# Altium project AQM with ESP32-C3.PrjPcb
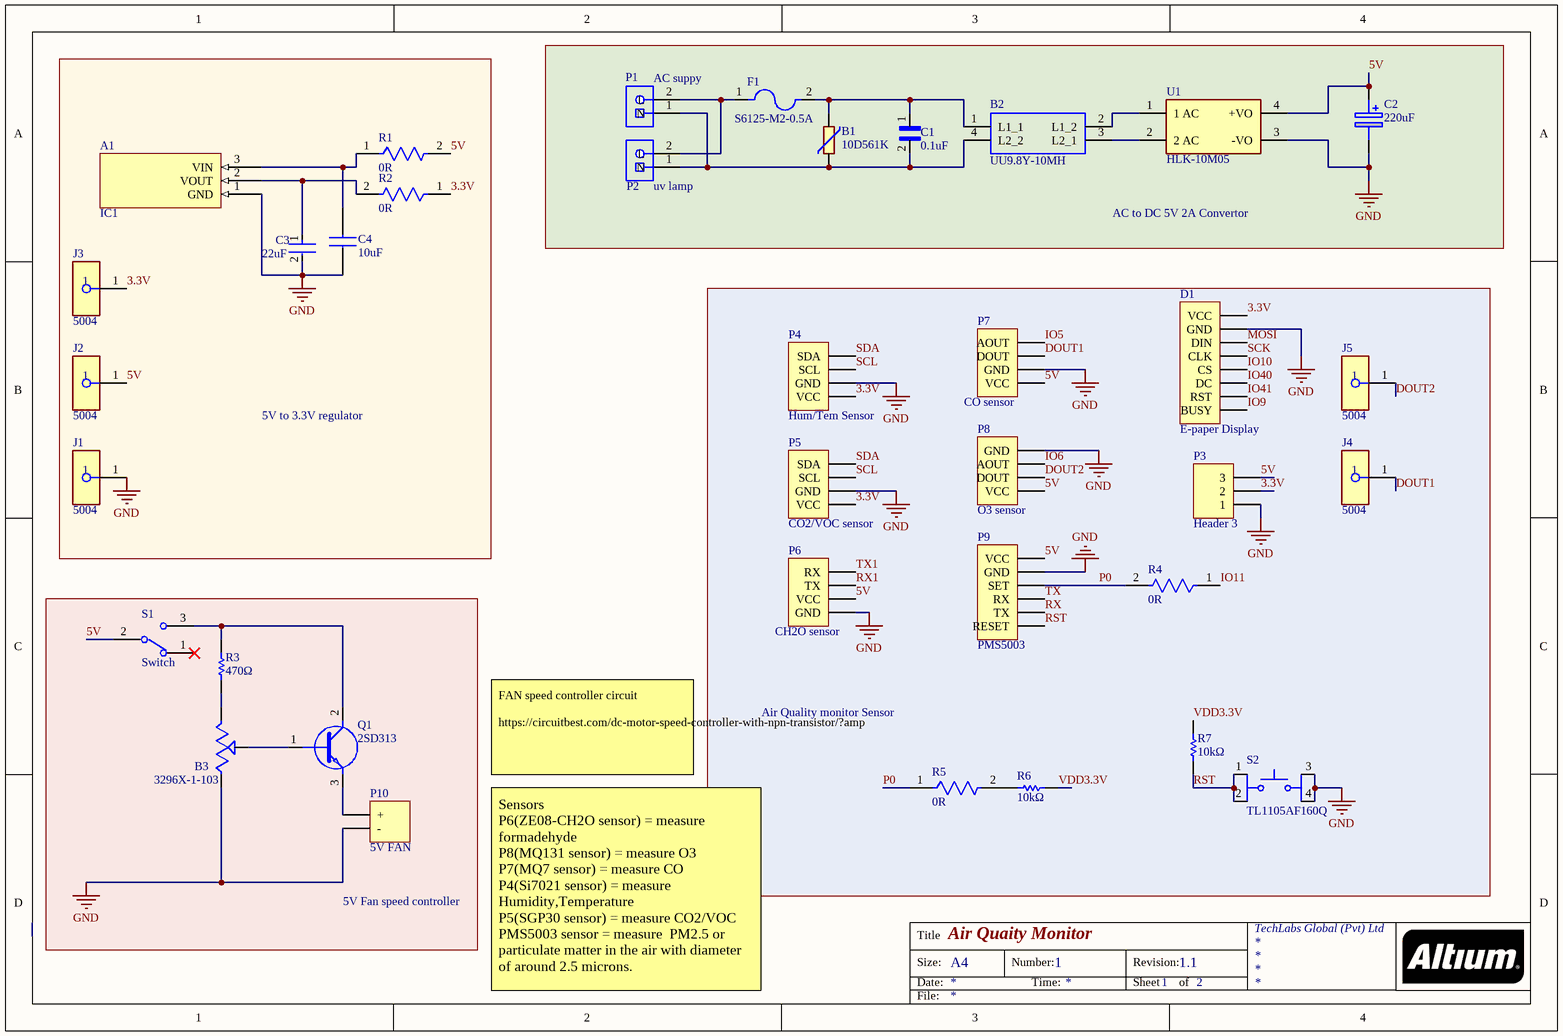
[diagram p0: AQM with esp32.SchDoc]
2 sheets, 62 parts. Net scope: global (net labels, ports and power ports of the same name join across sheets).
Board file: AQM with ESP32-C3.PcbDoc
Sheets:
  AQM with esp32.SchDoc
  esp32-c3 module.SchDoc

## Sheet AQM with esp32.SchDoc: Air Quaity Monitor
size A4; Organization: TechLabs Global (Pvt) Ltd; DocumentNumber: 1; Revision: 1.1; SheetNumber: 1; SheetTotal: 2

### Parts
(Parts that share a designator on the sheet are numbered #1, #2 ... from top to bottom, then left to right.)
A1  IC1  [SOT89-150P350X150-3N]
B1  10D561K  [10D561K]
B2  UU9.8Y-10MH  [UU98Y10MH]
B3  3296X-1-103  [3296X1223LF]
C1  0.1uF  [MPX-104K275VAC-C-D2]
C2  220uF  [CAPAE830X1050N]
C3  22uF  [FP-GRM219-0_2-0_15-IPC_A]
C4  10uF  [CL05A106MQ5NUNC]
D1  E-paper Display  [HDR1X8]
F1  S6125-M2-0.5A  [CAPC6125X25N]
J1  5004  [FP-5004-MFG]
J2  5004  [FP-5004-MFG]
J3  5004  [FP-5004-MFG]
J4  5004  [FP-5004-MFG]
J5  5004  [FP-5004-MFG]
P1  AC suppy  [PHOE-1729128-2_V]
P2  uv lamp  [PHOE-1729128-2_V]
P3  Header 3  [HDR1X3]
P4  Hum/Tem Sensor  [HDR1X4]
P5  CO2/VOC sensor  [HDR1X4]
P6  CH2O sensor  [HDR1X4]
P7  CO sensor  [HDR1X4]
P8  O3 sensor  [HDR1X4]
P9  PMS5003  [HDR1X6]
P10  5V FAN  [HDR1X2]
Q1  2SD313  [TO304P498X1010X2089-3P]
R1  0R  [FP-RC0402-0_4-IPC_A]
R2  0R  [FP-RC0402-0_4-IPC_A]
R3  470Ω  [RESC1608X55X25LL10T15]
R4#1  0R  [FP-RC0402-0_4-IPC_A]
R5#1  0R  [FP-RC0402-0_4-IPC_A]
R6#1  10kΩ  [RESC1005X40X25LL05T10]
R7#1  10kΩ  [RESC1005X40X25LL05T10]
S1  Switch  [SK3245SL1A]
S2#1  TL1105AF160Q  [TL1105AF160Q]
U1  HLK-10M05  [FP-HLK-10M05-MFG]

### Blocks framed on the sheet
5V to 3.3V regulator: A1 C3 C4 J1-J3 R1 R2
AC to DC 5V 2A Convertor: B1 B2 C1 C2 F1 P1 P2 U1
Air Quality monitor Sensor: D1 J4 J5 P3-P9 R4#1 R5#1 R6#1 R7#1 S2#1
5V Fan speed controller: B3 P10 Q1 R3 S1

### Nets
GND: A1.1(GND) B3.1(A) C2.2(-) C3.2 C4.1 D1.7(GND) J1.1 P3.1 P4.2(GND) P5.2(GND) P6.1(GND) P7.2(GND) P8.4(GND) P9.5(GND) P10.2(-) S2#1.3 S2#1.4 U1.3(-VO)
3.3V: D1.8(VCC) J3.1 P3.2 P4.1(VCC) P5.1(VCC) R2.1
5V: C2.1(+) J2.1 P3.3 P6.2(VCC) P7.1(VCC) P8.1(VCC) P9.6(VCC) R1.2 S1.2 U1.4(+VO)
DOUT1: J4.1 P7.3(DOUT)
DOUT2: J5.1 P8.2(DOUT)
IO5: P7.4(AOUT)
IO6: P8.3(AOUT)
IO9: D1.1(BUSY)
IO10: D1.4(CS)
IO11: R4#1.1
IO40: D1.3(DC)
IO41: D1.2(RST)
MOSI: D1.6(DIN)
P0: P9.4(SET) R4#1.2 R5#1.1
RST: P9.1(RESET) R7#1.2 S2#1.1 S2#1.2
RX: P9.2(TX)
RX1: P6.3(TX)
SCK: D1.5(CLK)
SCL: P4.3(SCL) P5.3(SCL)
SDA: P4.4(SDA) P5.4(SDA)
TX: P9.3(RX)
TX1: P6.4(RX)
VDD3.3V: R6#1.1 R7#1.1
NetA1_2: A1.2(VOUT) C3.1 R2.2
NetA1_3: A1.3(VIN) C4.2 R1.1
NetB1_1: B1.1 B2.1(L1_1) C1.1 F1.2
NetB1_2: B1.2 B2.4(L2_2) C1.2 P1.1(N) P2.1(N)
NetB2_2: B2.2(L1_2) U1.1(1_AC)
NetB2_3: B2.3(L2_1) U1.2(2_AC)
NetB3_2: B3.2(B) Q1.1(B)
NetB3_3: B3.3(C) R3.1
NetF1_1: F1.1 P1.2(L) P2.2(L)
NetP10_1: P10.1(+) Q1.3(E)
NetQ1_2: Q1.2(C) R3.2 S1.3
NetR5#1_2: R5#1.2 R6#1.2

Not connected (* = marked no-connect by the designer): S1 1*

### Notes on the sheet
- FAN speed controller circuit
  https://circuitbest.com/dc-motor-speed-controller-with-npn-transistor/?amp
- Sensors
  P6(ZE08-CH2O sensor) = measure formadehyde
  P8(MQ131 sensor) = measure O3
  P7(MQ7 sensor) = measure CO
  P4(Si7021 sensor) = measure Humidity,Temperature
  P5(SGP30 sensor) = measure CO2/VOC
  PMS5003 sensor = measure  PM2.5 or particulate matter in the air with diameter of around 2.5 microns.
- Title
- Size:
- Date:
- A4
- Number:
- Time:
- Revision:
- Sheet
- of
- File:

### Library data of the parts
A1 = IC?: 75dB@(120Hz) 1A 1.25V@(1A) ±125℃@(Tj) Fixed 3.3V~3.3V Positive 1 20V SOT-89 Linear Voltage Regulators (LDO) ROHS; Manufacturer: YONGYUTAI; Mfr. Part #: AMS1117-3.3; LCSC Part #: C2904742; Package: SOT-89; Datasheet: https://datasheet.lcsc.com/lcsc/2110121330_YONGYUTAI-AMS1117-3-3_C2904742.pdf
B1 = 10D561K: 920V 42.3J 180pF@1kHz 460V 350V 504V~616V 2.5kA Plugin Varistors ROHS; Manufacturer: Hongzhi Elec; Datasheet: https://datasheet.lcsc.com/lcsc/1811141751_Hongzhi-Elec-10D561K_C113236.pdf; LCSC Part #: C113236; Mfr. Part #: 10D561K; Package: Plugin
B2 = UU9.8Y-10MH: 10mH@1kHz 1.2Ω 2 500mA 50V Plugin Common Mode Filters ROHS; Manufacturer: FH (Guangdong Fenghua Advanced Tech); Mfr. Part #: UU9.8Y-10MH; Package: Plugin; Datasheet: https://datasheet.lcsc.com/lcsc/1810311213_FH--Guangdong-Fenghua-Advanced-Tech-UU9-8Y-10mH_C75192.pdf; LCSC Part #: C75192
B3 = 3296X-1-103: ±10% 10kΩ Plugin Variable Resistors/Potentiometers ROHS; Manufacturer: BOCHEN(Chengdu Guosheng Tech); Mfr. Part #: 3296X-1-103; Package: Plugin; LCSC Part #: C118955; Datasheet: https://datasheet.lcsc.com/lcsc/1811011704_BOCHEN-Chengdu-Guosheng-Tech-3296X-1-103_C118955.pdf
C1 = MPX-104K275VAC-C-D2: X2 100nF ±10% 275V Plugin,P=15mm Suppression Capacitors ROHS; Manufacturer: NDF; Mfr. Part #: X2-104K-275VAC; LCSC Part #: C914484; Package: Plugin,P=15mm; Datasheet: https://datasheet.lcsc.com/lcsc/2201131300_NDF-X2-104K-275VAC_C914484.pdf; Value: 0.1uF
C2 = UUR1C221MNL1GS: -40℃~+85℃ 2000hrs@85℃ 220uF 10mm 16V 8mm 215mA@120Hz ±20% SMD,D8xL10mm Aluminum Electrolytic Capacitors - SMD ROHS; Manufacturer: Nichicon; Mfr. Part #: UUR1C221MNL1GS; Package: SMD,D8xL10mm; Datasheet: https://datasheet.lcsc.com/lcsc/2002121532_Nichicon-UUR1C221MNL1GS_C445237.pdf; LCSC Part #: C445237; Value: 220uF
C3 = CMP-06035-056251-1: Chip Multilayer Ceramic Capacitors for General Purpose, 0805, 22uF, X5R, 15%, 20%, 16V; Mfr. Part #: GRM219R61C226ME15L; Manufacturer: Murata Electronics; value: 22uF; Datasheet: https://datasheet.lcsc.com/lcsc/1811141821_Murata-Electronics-GRM219R61C226ME15L_C162295.pdf; LCSC Part #: C162295; Package: 0805
C4 = CL05A106MQ5NUNC: 6.3V 10uF X5R ±20% 0402 Multilayer Ceramic Capacitors MLCC - SMD/SMT ROHS; Manufacturer: Samsung Electro-Mechanics; Mfr. Part #: CL05A106MQ5NUNC; LCSC Part #: C15525; value: 10uF; Datasheet Link: https://datasheet.datasheetarchive.com/originals/distributors/Datasheets-DGA10/2406160.pdf; Package: 0402
D1 = Header 8: Header, 8-Pin; LatestRevisionDate: 17-Jul-2002; LatestRevisionNote: Re-released for DXP Platform.; Publisher: Altium Limited
F1 = S6125-M2-0.5A: SMD Fuses ROHS; Manufacturer: SART(Nanjing Sart Tech); LCSC Part #: C845172; Mfr. Part #: S6125-M2-0.5A; Package: SMD; Datasheet: https://datasheet.lcsc.com/lcsc/2201242130_SART-Nanjing-Sart-Tech-S6125-M2-0-5A_C845172.pdf
J1-J5 = CMP-2000-05575-2: PC TEST POINT MINIATURE YELLOW; Manufacturer: Keystone; Datasheet: https://datasheet.lcsc.com/lcsc/2201121200_Keystone-5004_C2906762.pdf; LCSC Part #: C2906762; ComponentLink2URL: https://www.keyelco.com/product-pdf.cfm?p=1313; ComponentLink2Description: Datasheet; Package: 5004; Mfr. Part #: 5004
P1 P2 = CMP-2000-05815-1: 13.5A 400V Green Straight pin 5.08mm 1 2 Plugin,P=5.08mm Screw terminal ROHS; Mfr. Part #: 1729128; Manufacturer: Phoenix Contact; Datasheet: https://www.farnell.com/datasheets/2617011.pdf; LCSC Part #: C91153; Package: Plugin,P=5.08mm
P3 = Header 3: Header, 3-Pin; LatestRevisionDate: 17-Jul-2002; LatestRevisionNote: Re-released for DXP Platform.; Publisher: Altium Limited
P4 = Header 4: Si7021 Header, 4-Pin
P5 = Header 4: SGP30 Header, 4-Pin; LatestRevisionDate: 17-Jul-2002; LatestRevisionNote: Re-released for DXP Platform.; Publisher: Altium Limited
P6 = Header 4: - Sensor Modules ROHS; Mfr. Part #: ZE08-CH2O; Manufacturer: Zhengzhou Winsen Elec Tech; LCSC Part #: C141344
P7 = Header 4: MQ7 Header, 4-Pin; LatestRevisionDate: 17-Jul-2002; LatestRevisionNote: Re-released for DXP Platform.; Publisher: Altium Limited
P8 = Header 4: MQ131 Header, 4-Pin; LatestRevisionDate: 17-Jul-2002; LatestRevisionNote: Re-released for DXP Platform.; Publisher: Altium Limited
P9 = Header 6: PMS5003 Sensor Modules ROHS; Manufacturer: Beijing Plantower; Datasheet: https://datasheet.lcsc.com/lcsc/1810251510_Beijing-Plantower-PMS5003_C91431.pdf; LCSC Part #: C91431; Package: PMS5003; Mfr. Part #: PMS5003
P10 = Header 2: Header, 2-Pin; LatestRevisionDate: 17-Jul-2002; LatestRevisionNote: Re-released for DXP Platform.; Publisher: Altium Limited
Q1 = 2SD313: NPN Transistor, TO-220; Manufacturer: Jiangsu Changjing Electronics Technology Co., Ltd.; Mfr. Part #: 2SD313; Datasheet: https://datasheet.lcsc.com/lcsc/2206081730_Jiangsu-Changjing-Electronics-Technology-Co---Ltd--2SD313_C3031919.pdf; LCSC Part #: C3031919; Package: TO-220
R1 R2 R4#1 R5#1 = CMP-2002-07342-2: RES SMD 0 OHM JUMPER 1/16W 0402; Manufacturer: Yageo; Mfr. Part #: RC0402FR-070RL; value: 0R; Package: 0402; LCSC Part #: C106231; Datasheet: https://www.lcsc.com/product-detail/Chip-Resistor-Surface-Mount_YAGEO-RC0402FR-070RL_C106231.html
R3 = CMP-1659-00035-2: 100mW Thick Film Resistors 75V ±100ppm/℃ ±1% -55℃~+155℃ 470Ω 0603 Chip Resistor - Surface Mount ROHS; Mfr. Part #: RC0603FR-07470RL; Manufacturer: YAGEO; ComponentLink1Description: Manufacturer URL; Value: 470Ω; ComponentLink1URL: http://www.yageo.com/; LCSC Part #: C114669; ComponentLink2URL: https://datasheet.ciiva.com/11808/0900766b80f96399-11808177.pdf; Package: 0603; ComponentLink2Description: Datasheet; Datasheet: https://datasheet.lcsc.com/lcsc/1810161617_YAGEO-RC0603FR-07470RL_C114669.pdf
R6#1 R7#1 = CMP-2002-07353-1: 50V 10kΩ Thick Film Resistors 62.5mW ±1% -55℃~+155℃ ±100ppm/℃ 0402 Chip Resistor - Surface Mount ROHS; Mfr. Part #: RC0402FR-0710KL; Manufacturer: YAGEO; Value: 10kΩ; LCSC Part #: C60490; Package: 0402
S1 = SK-3245S-L1-A: Surface Mount 50mA DPDT 3.2mm 12V 9.1mm 12V 3.55mm 50mA 10000 SMDSplicing Rectangular columnar -40℃~+85℃ Black SMD Slide Switches ROHS; Manufacturer: XKB Connectivity; Package: SMD; Datasheet: https://datasheet.lcsc.com/lcsc/2002271841_XKB-Connectivity-SK-3245S-L1-A_C405951.pdf; Mfr. Part #: SK-3245S-L1-A; LCSC Part #: C405951
S2#1 = TL1105AF160Q: 6mm 1.4mm Round Button 50mA Straight 6mm SPST 12V Plugin,6x6mm Tactile Switches ROHS; Manufacturer: E-Switch; Datasheet: https://datasheet.lcsc.com/lcsc/1809291031_E-Switch-TL1105AF160Q_C273465.pdf; Mfr. Part #: TL1105AF160Q; Package: Plugin,6x6mm; LCSC Part #: C273465
U1 = CMP-218581-000001-1: 5V 2A 90VAC~265VAC 1 120V~350V Isolated Regulated 10W AC-DC 80% Plugin Power Modules ROHS; Manufacturer: HI-LINK; Mfr. Part #: HLK-10M05; LCSC Part #: C403745; Package: Plugin

## Sheet esp32-c3 module.SchDoc: ESP32-C3-WROOM-02
size A4; Organization: TechLabs Global (Pvt) Ltd; DocumentNumber: 2; Revision: 1.1; SheetNumber: 2; SheetTotal: 2
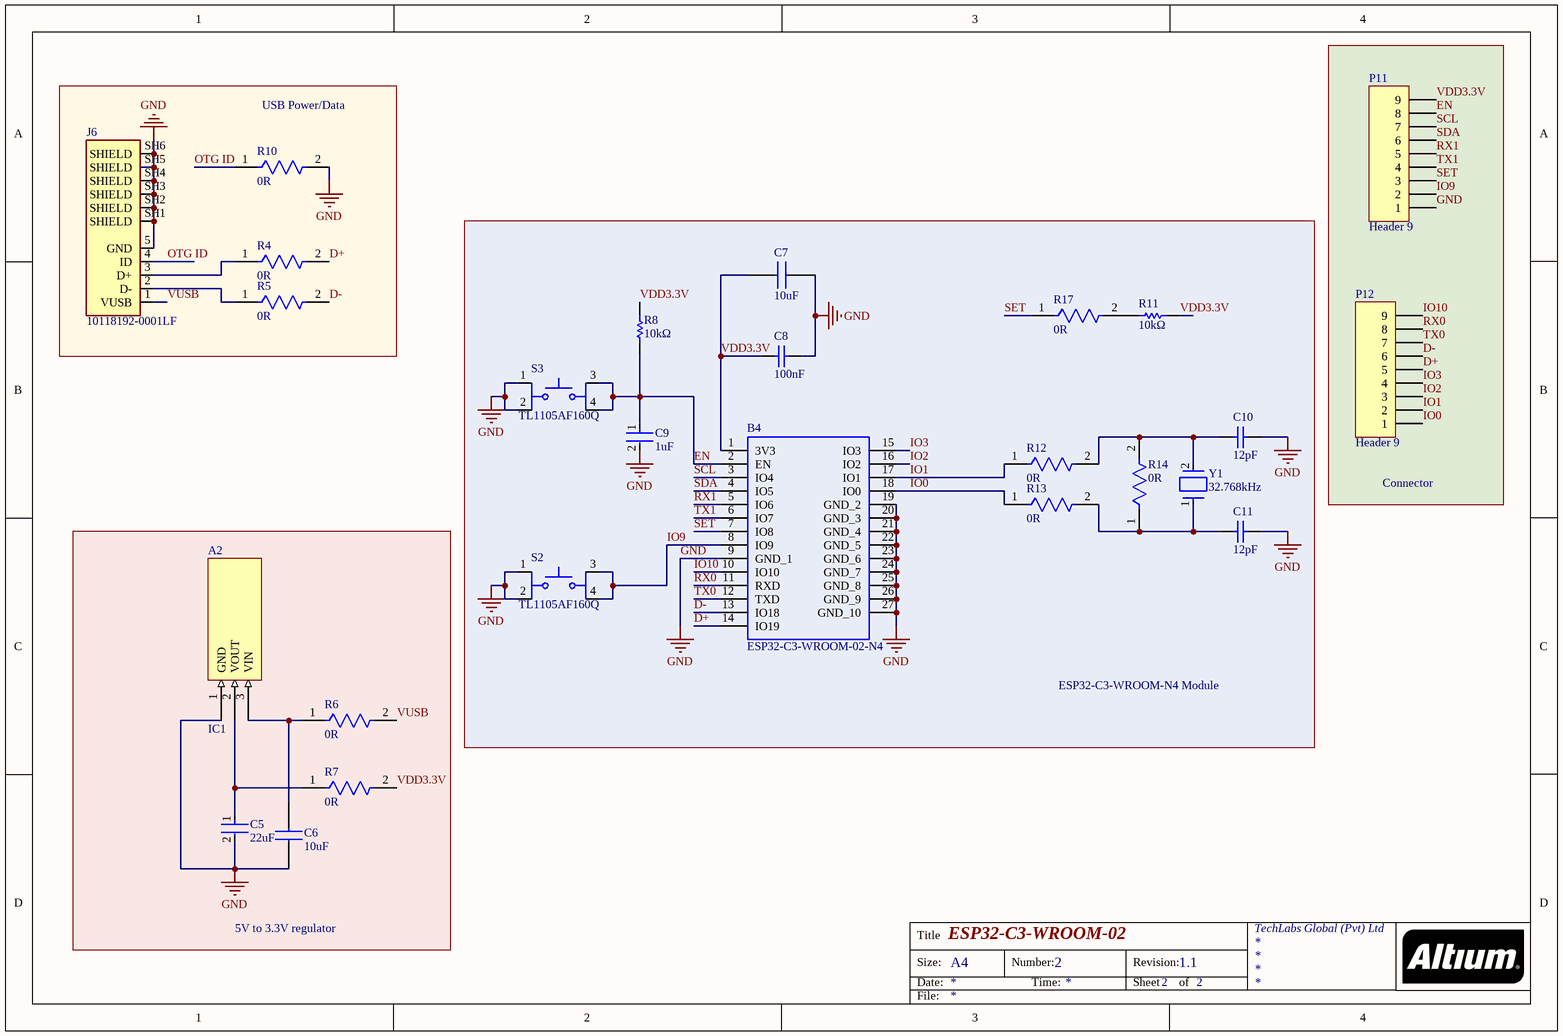
[diagram p1: esp32-c3 module.SchDoc]

### Parts
(Parts that share a designator on the sheet are numbered #1, #2 ... from top to bottom, then left to right.)
A2  IC1  [SOT89-150P350X150-3N]
B4  ESP32-C3-WROOM-02-N4  [ESP32C3WROOM02N4]
C5  22uF  [FP-GRM219-0_2-0_15-IPC_A]
C6  10uF  [CL05A106MQ5NUNC]
C7  10uF  [CL05A106MQ5NUNC]
C8  100nF  [CAPC1050X55X23ML05T13]
C9  1uF  [FP-CL511-IPC_C]
C10  12pF  [CAPC1608X90X30LL10T20]
C11  12pF  [CAPC1608X90X30LL10T20]
J6  10118192-0001LF  [AMPHENOL_10118192-0001LF]
P11  Header 9  [HDR1X9]
P12  Header 9  [HDR1X9]
R4#2  0R  [FP-RC0402-0_4-IPC_A]
R5#2  0R  [FP-RC0402-0_4-IPC_A]
R6#2  0R  [FP-RC0402-0_4-IPC_A]
R7#2  0R  [FP-RC0402-0_4-IPC_A]
R8  10kΩ  [RESC1005X40X25LL05T10]
R10  0R  [FP-RC0402-0_4-IPC_A]
R11  10kΩ  [RESC1005X40X25LL05T10]
R12  0R  [FP-RC0402-0_4-IPC_A]
R13  0R  [FP-RC0402-0_4-IPC_A]
R14  0R  [FP-RC0402-0_4-IPC_A]
R17  0R  [FP-RC0402-0_4-IPC_A]
S2#2  TL1105AF160Q  [TL1105AF160Q]
S3  TL1105AF160Q  [TL1105AF160Q]
Y1  32.768kHz  [FP-ABS07-MFG]

### Blocks framed on the sheet
USB Power/Data: J6 R4#2 R5#2 R10
Connector: P11 P12
ESP32-C3-WROOM-N4 Module: B4 C7-C11 R8 R11-R14 R17 S2#2 S3 Y1
5V to 3.3V regulator: A2 C5 C6 R6#2 R7#2

### Nets
GND: A2.1(GND) B4.9(GND_1) B4.19(GND_2) B4.20(GND_3) B4.21(GND_4) B4.22(GND_5) B4.23(GND_6) B4.24(GND_7) B4.25(GND_8) B4.26(GND_9) B4.27(GND_10) C5.2 C6.1 C7.2 C8.2 C9.2 C10.2 C11.2 J6.5(GND) J6.SH1(SHIELD) J6.SH2(SHIELD) J6.SH3(SHIELD) J6.SH4(SHIELD) J6.SH5(SHIELD) J6.SH6(SHIELD) P11.1 R10.2 S2#2.1 S2#2.2 S3.1 S3.2
D+: B4.14(IO19) P12.5 R4#2.2
D-: B4.13(IO18) P12.6 R5#2.2
EN: B4.2(EN) C9.1 P11.8 R8.2 S3.3 S3.4
IO0: B4.18(IO0) P12.1 R13.1
IO1: B4.17(IO1) P12.2 R12.1
IO2: B4.16(IO2) P12.3
IO3: B4.15(IO3) P12.4
IO9: B4.8(IO9) P11.2 S2#2.3 S2#2.4
IO10: B4.10(IO10) P12.9
OTG ID: J6.4(ID) R10.1
RX0: B4.11(RXD) P12.8
RX1: B4.5(IO6) P11.5
SCL: B4.3(IO4) P11.7
SDA: B4.4(IO5) P11.6
SET: B4.7(IO8) P11.3 R17.1
TX0: B4.12(TXD) P12.7
TX1: B4.6(IO7) P11.4
VDD3.3V: B4.1(3V3) C7.1 C8.1 P11.9 R7#2.2 R8.1 R11.1
VUSB: J6.1(VUSB) R6#2.2
NetA2_2: A2.2(VOUT) C5.1 R7#2.1
NetA2_3: A2.3(VIN) C6.2 R6#2.1
NetC10_1: C10.1 R12.2 R14.2 Y1.2
NetC11_1: C11.1 R13.2 R14.1 Y1.1
NetJ6_2: J6.2(D-) R5#2.1
NetJ6_3: J6.3(D+) R4#2.1
NetR11_2: R11.2 R17.2

### Notes on the sheet
- Title
- Size:
- Date:
- A4
- Number:
- Time:
- Revision:
- Sheet
- of
- File:

### Library data of the parts
A2 = IC?: as A1 on sheet AQM with esp32; LCSC Part #: C2904742; Package: SOT-89; Datasheet: https://datasheet.lcsc.com/lcsc/2110121330_YONGYUTAI-AMS1117-3-3_C2904742.pdf
B4 = ESP32-C3-WROOM-02-N4: WiFi Modules (802.11) (Engineering Samples) SMD module, ESP32-C3, 4MB SPI flash, PCB antenna, -40 C +85 C; Manufacturer: Espressif Systems; Mfr. Part #: ESP32-C3-WROOM-02-N4; LCSC Part #: C2934560; Datasheet: https://www.espressif.com/sites/default/files/documentation/esp32-c3-wroom-02_datasheet_en.pdf
C5 = CMP-06035-056251-1: as C3 on sheet AQM with esp32; value: 22uF; Datasheet: https://datasheet.lcsc.com/lcsc/1811141821_Murata-Electronics-GRM219R61C226ME15L_C162295.pdf; LCSC Part #: C162295; Package: 0805
C6 C7 = CL05A106MQ5NUNC: as C4 on sheet AQM with esp32; Mfr. Part #: CL05A106MQ5NUNC; LCSC Part #: C15525; value: 10uF; Datasheet Link: https://datasheet.datasheetarchive.com/originals/distributors/Datasheets-DGA10/2406160.pdf; Package: 0402
C8 = CMP-2000-05439-1: X7R 100nF 16V ±10% 0402 Multilayer Ceramic Capacitors MLCC - SMD/SMT ROHS; Manufacturer: Samsung Electro-Mechanics; Mfr. Part #: CL05B104KO5NNNC; Package: 0402; Value: 100nF; Datasheet: https://datasheet.lcsc.com/lcsc/1810191219_Samsung-Electro-Mechanics-CL05B104KO5NNNC_C1525.pdf; LCSC Part #: C1525
C9 = CMP-13271-001936-1: X5R 10V 1uF ±10% 0402 Multilayer Ceramic Capacitors MLCC - SMD/SMT ROHS; Manufacturer: Samsung Electro-Mechanics; Mfr. Part #: CL05A105KP5NNNC; Package: 0402; Value: 1uF; LCSC Part #: C14445; Datasheet: https://datasheet.lcsc.com/lcsc/1810191214_Samsung-Electro-Mechanics-CL05A105KP5NNNC_C14445.pdf
C10 C11 = CMP-2000-06098-1: 50V 12pF C0G ±5% 0603 Multilayer Ceramic Capacitors MLCC - SMD/SMT ROHS; Manufacturer: Samsung Electro-Mechanics; Mfr. Part #: CL10C120JB8NNNC; Datasheet: https://datasheet.lcsc.com/lcsc/1810261515_Samsung-Electro-Mechanics-CL10C120JB8NNNC_C38523.pdf; Package: 0603; LCSC Part #: C38523; Value: 12pF
J6 = 10118192-0001LF: Single Port 5 Contact Horizontal Right Angle Shielded Micro B USB 2.0 Connector; Manufacturer: Amphenol ICC; Mfr. Part #: 10118192-0001LF; Package: SMD; LCSC Part #: C132564; Datasheet: https://datasheet.lcsc.com/lcsc/2111290930_Amphenol-ICC-10118192-0001LF_C132564.pdf
P11 P12 = Header 9: Header, 9-Pin; LatestRevisionDate: 17-Jul-2002; LatestRevisionNote: Re-released for DXP Platform.; Publisher: Altium Limited
R4#2 R5#2 R6#2 R7#2 R10 R12-R14 R17 = CMP-2002-07342-2: as R1 on sheet AQM with esp32; value: 0R; Package: 0402; LCSC Part #: C106231; Datasheet: https://www.lcsc.com/product-detail/Chip-Resistor-Surface-Mount_YAGEO-RC0402FR-070RL_C106231.html
R8 R11 = CMP-2002-07353-1: as R6#1 on sheet AQM with esp32; Value: 10kΩ; LCSC Part #: C60490; Package: 0402
S2#2 S3 = TL1105AF160Q: as S2#1 on sheet AQM with esp32; Datasheet: https://datasheet.lcsc.com/lcsc/1809291031_E-Switch-TL1105AF160Q_C273465.pdf; Mfr. Part #: TL1105AF160Q; Package: Plugin,6x6mm; LCSC Part #: C273465
Y1 = CMP-0447-00001-4: -40℃~+85℃ 32.768kHz 12.5pF 70kΩ ±20ppm SMD3215-2P Crystals ROHS; Manufacturer: Abracon LLC; Mfr. Part #: ABS07-32.768KHZ-T; Value: 32.768kHz; LCSC Part #: C130253; Package: SMD3215-2P; Datasheet: https://datasheet.lcsc.com/lcsc/1809211224_Abracon-LLC-ABS07-32-768KHZ-T_C130253.pdf

## Nets that join several sheets
GND: AQM with esp32 (18 pins), esp32-c3 module (31 pins)
IO9: AQM with esp32 (D1.1), esp32-c3 module (B4.8 P11.2 S2#2.3 S2#2.4)
IO10: AQM with esp32 (D1.4), esp32-c3 module (B4.10 P12.9)
RX1: AQM with esp32 (P6.3), esp32-c3 module (B4.5 P11.5)
SCL: AQM with esp32 (P4.3 P5.3), esp32-c3 module (B4.3 P11.7)
SDA: AQM with esp32 (P4.4 P5.4), esp32-c3 module (B4.4 P11.6)
TX1: AQM with esp32 (P6.4), esp32-c3 module (B4.6 P11.4)
VDD3.3V: AQM with esp32 (R6#1.1 R7#1.1), esp32-c3 module (7 pins)